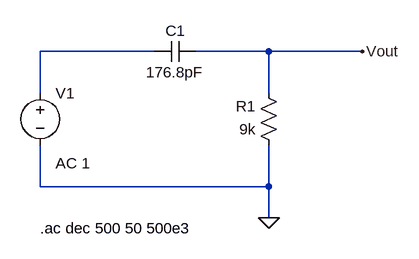
[diagram p0: schematic exercise4_assignment3.asc]
exercise4_assignment3.asc, the LTspice schematic file:
Version 4
SHEET 1 880 680
WIRE 160 48 -16 48
WIRE 336 48 224 48
WIRE 480 48 336 48
WIRE -16 112 -16 48
WIRE 336 112 336 48
WIRE -16 256 -16 192
WIRE 336 256 336 192
WIRE 336 256 -16 256
WIRE 336 304 336 256
FLAG 336 304 0
FLAG 480 48 Vout
SYMBOL voltage -16 96 R0
WINDOW 123 24 124 Left 2
WINDOW 39 0 0 Left 0
SYMATTR InstName V1
SYMATTR Value ""
SYMATTR Value2 AC 1
SYMBOL res 352 208 R180
WINDOW 0 36 76 Left 2
WINDOW 3 36 40 Left 2
SYMATTR InstName R1
SYMATTR Value 9k
SYMBOL cap 224 32 R90
WINDOW 0 0 32 VBottom 2
WINDOW 3 32 32 VTop 2
SYMATTR InstName C1
SYMATTR Value 176.8pF
TEXT -16 320 Left 2 !.ac dec 500 50 500e3

The netlist it stands for:
* exercise4_assignment3.asc
V1 N001 0 AC 1
R1 0 Vout 9k
C1 Vout N001 176.8pF
.ac dec 500 50 500e3
.backanno
.end